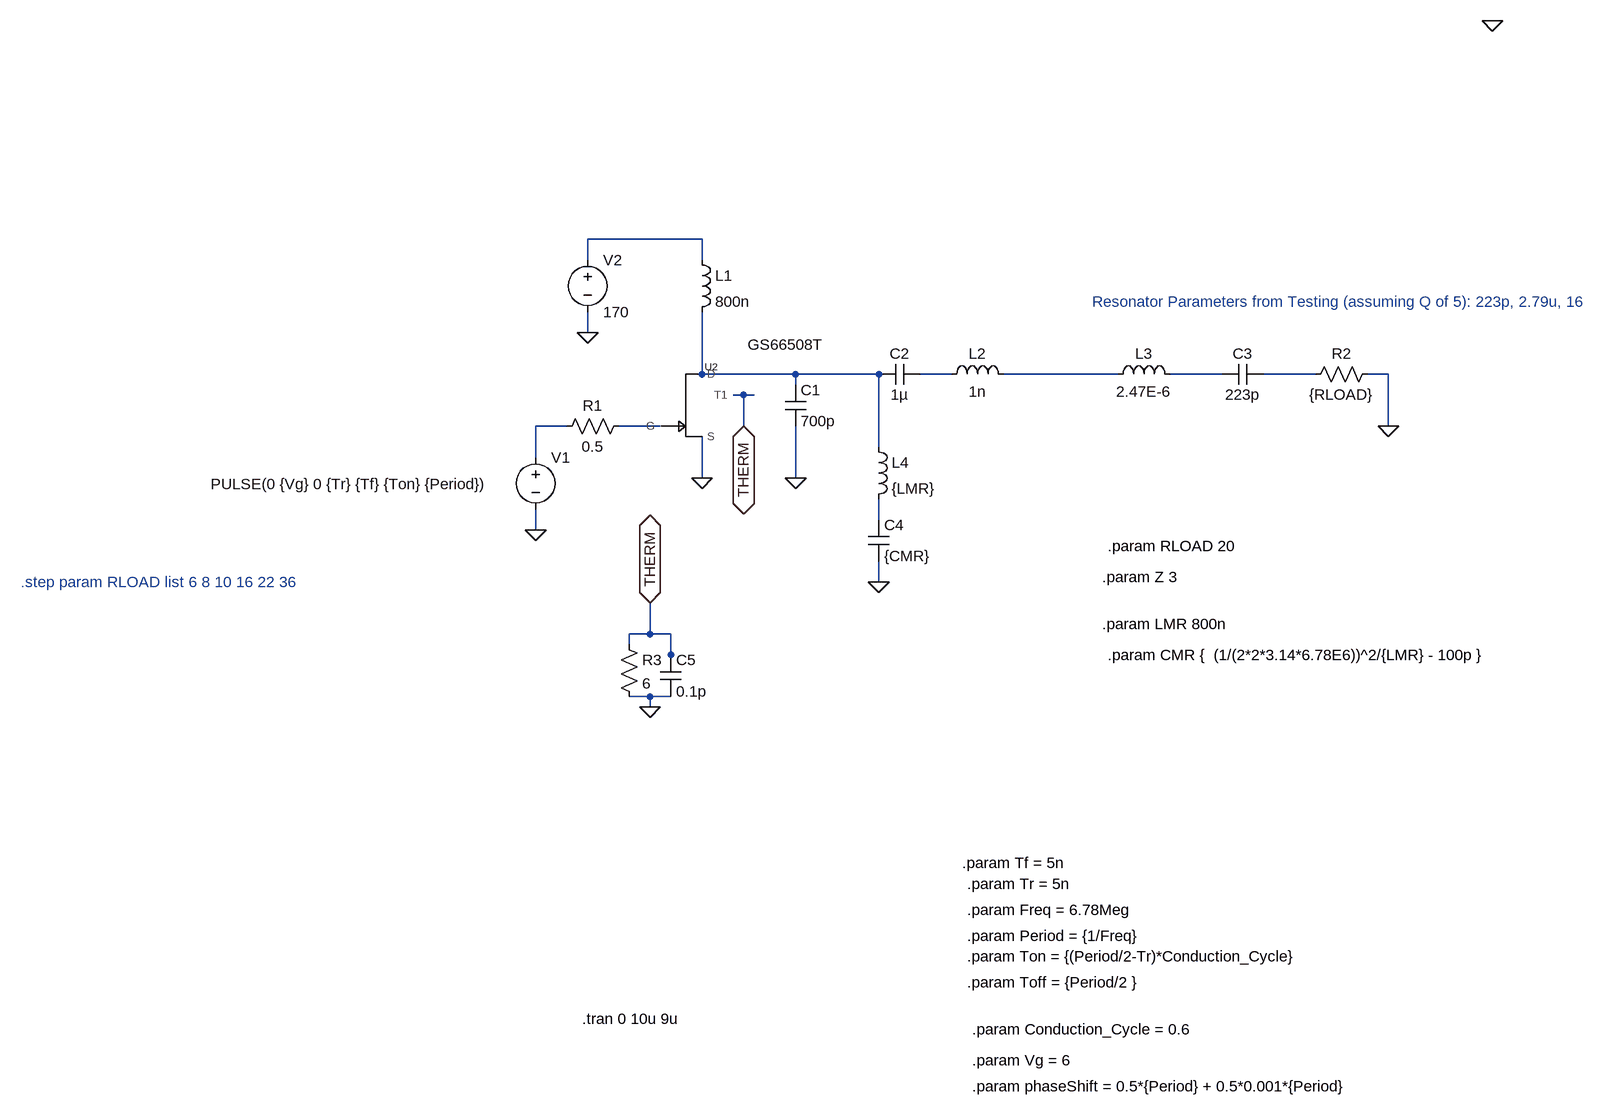
[diagram p0: schematic class_phi2_modified.asc]
class_phi2_modified.asc, the LTspice schematic file:
Version 4
SHEET 1 1108 776
WIRE -400 -544 -576 -544
WIRE -576 -512 -576 -544
WIRE -400 -512 -400 -544
WIRE -576 -400 -576 -432
WIRE -400 -336 -400 -432
WIRE -256 -336 -400 -336
WIRE -128 -336 -256 -336
WIRE -16 -336 -64 -336
WIRE 240 -336 64 -336
WIRE 400 -336 320 -336
WIRE 544 -336 464 -336
WIRE 656 -336 624 -336
WIRE -256 -320 -256 -336
WIRE -336 -304 -352 -304
WIRE -320 -304 -336 -304
WIRE -608 -256 -656 -256
WIRE -464 -256 -528 -256
WIRE -336 -256 -336 -304
WIRE 656 -256 656 -336
WIRE -128 -224 -128 -336
WIRE -656 -208 -656 -256
WIRE -400 -176 -400 -240
WIRE -256 -176 -256 -256
WIRE -128 -112 -128 -144
WIRE -656 -96 -656 -128
WIRE -128 -16 -128 -48
WIRE -480 64 -480 16
WIRE -480 64 -512 64
WIRE -448 64 -480 64
WIRE -512 80 -512 64
WIRE -448 96 -448 64
WIRE -448 112 -448 96
WIRE -480 160 -512 160
WIRE -448 160 -480 160
WIRE -480 176 -480 160
FLAG -400 -176 0
FLAG -256 -176 0
FLAG -656 -96 0
FLAG -576 -400 0
FLAG 816 -880 0
FLAG 656 -256 0
FLAG -128 -16 0
FLAG -336 -256 THERM
IOPIN -336 -256 BiDir
FLAG -480 176 0
FLAG -480 16 THERM
IOPIN -480 16 BiDir
SYMBOL voltage -656 -224 R0
WINDOW 3 -500 57 Left 2
WINDOW 123 0 0 Left 2
WINDOW 39 0 0 Left 2
SYMATTR Value PULSE(0 {Vg} 0 {Tr} {Tf} {Ton} {Period})
SYMATTR InstName V1
SYMBOL GaN_E-HEMT_LT_GS66508T -448 -288 R0
SYMATTR InstName U2
SYMBOL ind -416 -528 R0
SYMATTR InstName L1
SYMATTR Value 800n
SYMBOL res -512 -272 R90
WINDOW 0 0 56 VBottom 2
WINDOW 3 32 56 VTop 2
SYMATTR InstName R1
SYMATTR Value 0.5
SYMBOL cap -272 -320 R0
SYMATTR InstName C1
SYMATTR Value 700p
SYMBOL cap -64 -352 R90
WINDOW 0 0 32 VBottom 2
WINDOW 3 32 32 VTop 2
SYMATTR InstName C2
SYMATTR Value 1µ
SYMBOL ind -32 -320 R270
WINDOW 0 32 56 VTop 2
WINDOW 3 5 56 VBottom 2
SYMATTR InstName L2
SYMATTR Value 1n
SYMBOL voltage -576 -528 R0
WINDOW 123 0 0 Left 2
WINDOW 39 0 0 Left 2
SYMATTR InstName V2
SYMATTR Value 170
SYMBOL ind 224 -320 R270
WINDOW 0 32 56 VTop 2
WINDOW 3 5 56 VBottom 2
SYMATTR InstName L3
SYMATTR Value 2.47E-6
SYMBOL cap 464 -352 R90
WINDOW 0 0 32 VBottom 2
WINDOW 3 32 32 VTop 2
SYMATTR InstName C3
SYMATTR Value 223p
SYMBOL res 640 -352 R90
WINDOW 0 0 56 VBottom 2
WINDOW 3 32 56 VTop 2
SYMATTR InstName R2
SYMATTR Value {RLOAD}
SYMBOL ind -144 -240 R0
SYMATTR InstName L4
SYMATTR Value {LMR}
SYMBOL cap -144 -112 R0
SYMATTR InstName C4
SYMATTR Value {CMR}
SYMBOL res -528 64 R0
SYMATTR InstName R3
SYMATTR Value 6
SYMBOL cap -464 96 R0
SYMATTR InstName C5
SYMATTR Value 0.1p
TEXT 0 416 Left 2 !.param Tf = 5n
TEXT 8 448 Left 2 !.param Tr = 5n
TEXT 8 488 Left 2 !.param Freq = 6.78Meg
TEXT 8 528 Left 2 !.param Period = {1/Freq}
TEXT 8 560 Left 2 !.param Ton = {(Period/2-Tr)*Conduction_Cycle}
TEXT 8 600 Left 2 !.param Toff = {Period/2 }
TEXT -584 656 Left 2 !.tran 0 10u 9u
TEXT 16 672 Left 2 !.param Conduction_Cycle = 0.6
TEXT 16 720 Left 2 !.param Vg = 6
TEXT -1448 -16 Left 2 ;.step param RLOAD list 6 8 10 16 22 36
TEXT 224 -72 Left 2 !.param RLOAD 20
TEXT 16 760 Left 2 !.param phaseShift = 0.5*{Period} + 0.5*0.001*{Period}
TEXT 200 -448 Left 2 ;Resonator Parameters from Testing (assuming Q of 5): 223p, 2.79u, 16
TEXT 216 -24 Left 2 !.param Z 3
TEXT 216 48 Left 2 !.param LMR 800n
TEXT 224 96 Left 2 !.param CMR {  (1/(2*2*3.14*6.78E6))^2/{LMR} - 100p }

The netlist it stands for:
* class_phi2_modified.asc
V1 N007 0 PULSE(0 {Vg} 0 {Tr} {Tf} {Ton} {Period})
XU2 N008 N002 0 THERM GS66508T  ; pins G D S T1
L1 N001 N002 800n
R1 N008 N007 0.5
C1 N002 0 700p
C2 N003 N002 1µ
L2 N003 N004 1n
V2 N001 0 170
L3 N004 N005 2.47E-6
C3 N006 N005 223p
R2 0 N006 {RLOAD}
L4 N002 N009 {LMR}
C4 N009 0 {CMR}
R3 THERM 0 6
C5 THERM 0 0.1p
.param Tf = 5n
.param Tr = 5n
.param Freq = 6.78Meg
.param Period = {1/Freq}
.param Ton = {(Period/2-Tr)*Conduction_Cycle}
.param Toff = {Period/2 }
.tran 0 10u 9u
.param Conduction_Cycle = 0.6
.param Vg = 6
* .step param RLOAD list 6 8 10 16 22 36
.param RLOAD 20
.param phaseShift = 0.5*{Period} + 0.5*0.001*{Period}
* Resonator Parameters from Testing (assuming Q of 5): 223p, 2.79u, 16
.param Z 3
.param LMR 800n
.param CMR {  (1/(2*2*3.14*6.78E6))^2/{LMR} - 100p }
.lib GaN_LTspice_GS66508T_Release1p27.lib
.backanno
.end